# Altium schematic sheet Sheet1.SchDoc: DarkPhaser 7K
size A4; CompanyName: ElectroTodos; DrawnBy: Juan ET; Revision: A; SheetNumber: 1; SheetTotal: 1; Number: 25
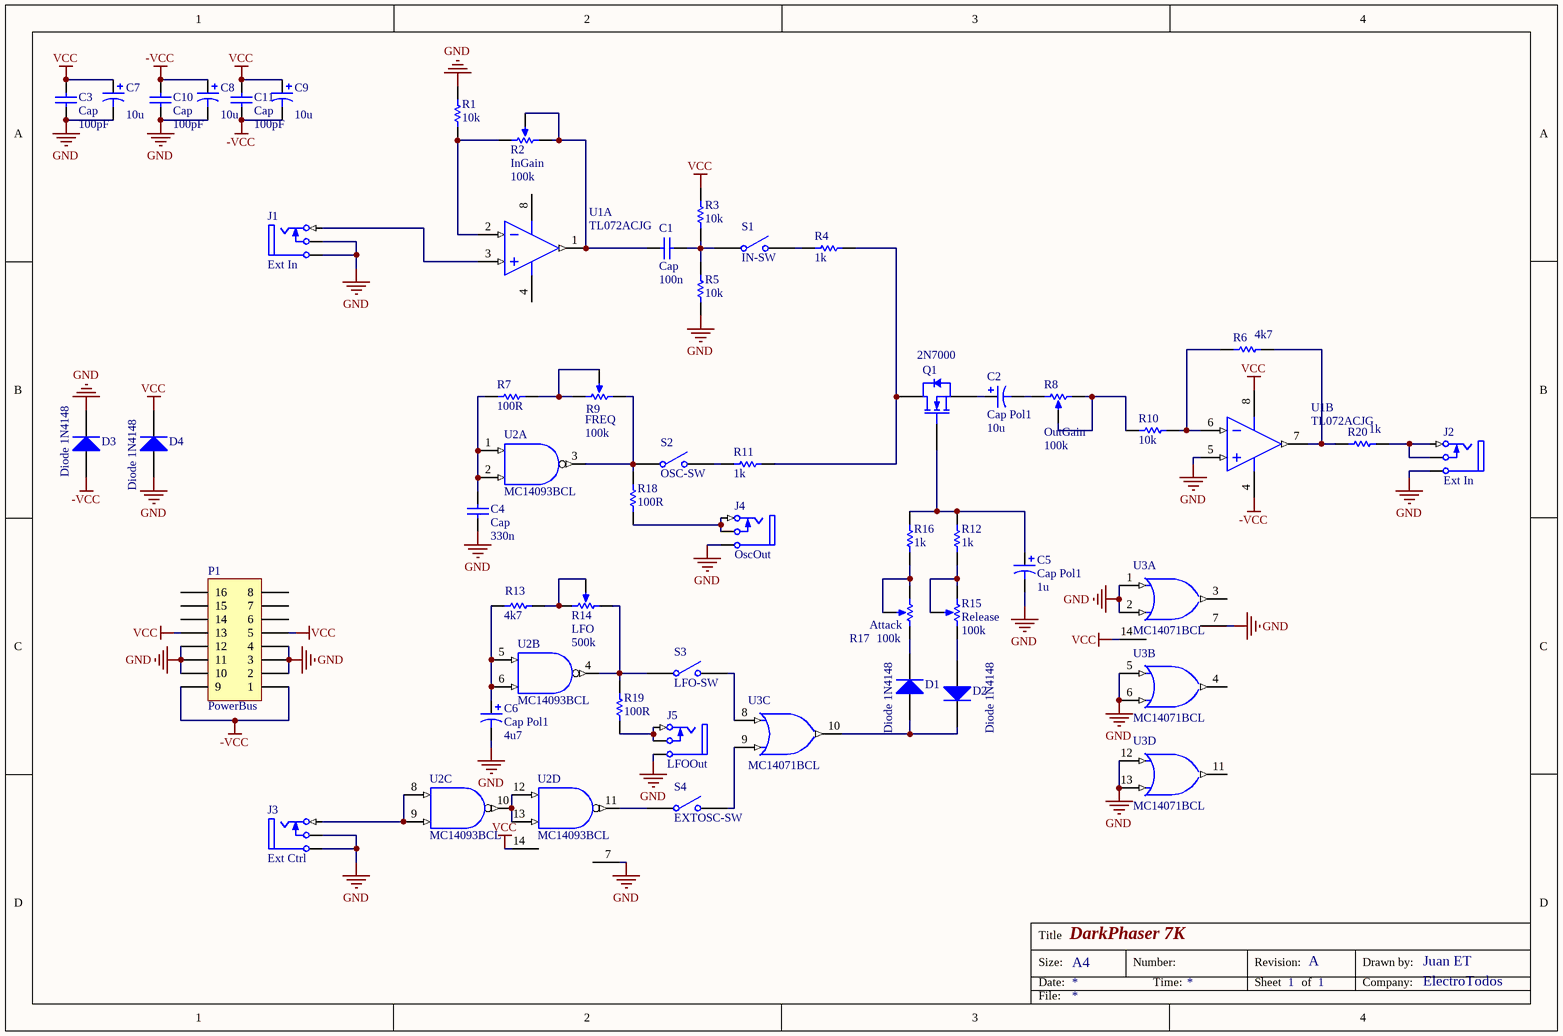
[diagram p0: Sheet1.SchDoc]

## Parts
C1  Cap  value 100n  [RAD-0.1]
C2  Cap Pol1  value 10u  [Cap Radial]
C3  Cap  value 100pF  [RAD-0.1]
C4  Cap  value 330n  [RAD-0.1]
C5  Cap Pol1  value 1u  [Cap Radial]
C6  Cap Pol1  value 4u7  [Cap Radial]
C7  value 10u  [Cap Radial]  (hidden comment: Cap Pol1)
C8  value 10u  [Cap Radial]  (hidden comment: Cap Pol1)
C9  value 10u  [Cap Radial]  (hidden comment: Cap Pol1)
C10  Cap  value 100pF  [RAD-0.1]
C11  Cap  value 100pF  [RAD-0.1]
D1  Diode 1N4148  [DO-35]
D2  Diode 1N4148  [DO-35]
D3  Diode 1N4148  [DO-35]
D4  Diode 1N4148  [DO-35]
J1  Ext In  [HDR1X3]
J2  Ext In  [HDR1X3]
J3  Ext Ctrl  [HDR1X3]
J4  OscOut  [HDR1X3]
J5  LFOOut  [HDR1X3]
P1  PowerBus  [HDR2X8_CEN]
Q1  2N7000  [SOT54]
R1  value 10k  [AXIAL-0.3]
R2  InGain  value 100k  [HDR1X3]
R3  value 10k  [AXIAL-0.3]
R4  value 1k  [AXIAL-0.3]
R5  value 10k  [AXIAL-0.3]
R6  value 4k7  [AXIAL-0.3]
R7  value 100R  [AXIAL-0.3]
R8  OutGain  value 100k  [HDR1X3]
R9  FREQ  value 100k  [HDR1X3]
R10  value 10k  [AXIAL-0.3]
R11  value 1k  [AXIAL-0.3]
R12  value 1k  [AXIAL-0.3]
R13  value 4k7  [AXIAL-0.3]
R14  LFO  value 500k  [HDR1X3]
R15  Release  value 100k  [HDR1X3]
R16  value 1k  [AXIAL-0.3]
R17  Attack  value 100k  [HDR1X3]
R18  value 100R  [AXIAL-0.3]
R19  value 100R  [AXIAL-0.3]
R20  value 1k  [AXIAL-0.3]
S1  IN-SW  [PIN2]
S2  OSC-SW  [PIN2]
S3  LFO-SW  [PIN2]
S4  EXTOSC-SW  [PIN2]
U1  TL072ACJG  [693-02]  (parts A,B of 2)
U2  MC14093BCL  [632-08]  (parts A,B,C,D of 4)
U3  MC14071BCL  [632-08]  (parts A,B,C,D of 4)

## Nets
-VCC: C8.1 C9.2 C10.2 C11.1 D3.1(A) P1.1 P1.9 U1.4(V-)
GND: C3.2 C4.1 C5.2 C6.2 C7.2 C8.2 C10.1 D3.2(K) D4.1(A) J1.2(TN) J1.5(S) J2.5(S) J3.2(TN) J3.5(S) J4.5(S) J5.5(S) P1.2 P1.3 P1.4 P1.10 P1.11 P1.12 R1.2 R5.2 U1.5(IN+) U2.7(GND) U3.1(A) U3.2(B) U3.5(A) U3.6(B) U3.7(GND) U3.12(A) U3.13(B)
VCC: C3.1 C7.1 C9.1 C11.2 D4.2(K) P1.5 P1.13 R3.1 U1.8(V+) U2.14(VDD) U3.14(VDD)  [also labelled VDD]
NetC1_1: C1.1 R3.2 R5.1 S1.1(COMMON)
NetC1_2: C1.2 R2.1(TOP) R2.3(TAP) U1.1(OUT)
NetC2_1: C2.1 Q1.3(S)
NetC2_2: C2.2 R8.1(TOP)
NetC4_2: C4.2 R7.1 U2.1(A) U2.2(B)
NetC5_1: C5.1 Q1.2(G) R12.2 R16.2
NetC6_1: C6.1 R13.1 U2.5(A) U2.6(B)
NetD1_1: D1.1(A) D2.2(K) U3.10(Y)
NetD1_2: D1.2(K) R17.2(BOT)
NetD2_1: D2.1(A) R15.2(BOT)
NetJ1_1: J1.1(T) U1.3(IN+)
NetJ2_1: J2.1(T) J2.2(TN) R20.1
NetJ3_1: J3.1(T) U2.8(A) U2.9(B)
NetJ4_1: J4.1(T) J4.2(TN) R18.1
NetJ5_1: J5.1(T) J5.2(TN) R19.1
NetQ1_1: Q1.1(D) R4.2 R11.2
NetR1_1: R1.1 R2.2(BOT) U1.2(IN-)
NetR4_1: R4.1 S1.2(NO)
NetR6_1: R6.1 R20.2 U1.7(OUT)
NetR6_2: R6.2 R10.1 U1.6(IN-)
NetR7_2: R7.2 R9.2(BOT) R9.3(TAP)
NetR8_2: R8.2(BOT) R8.3(TAP) R10.2
NetR9_1: R9.1(TOP) R18.2 S2.1(COMMON) U2.3(~{Y})
NetR11_1: R11.1 S2.2(NO)
NetR12_1: R12.1 R15.1(TOP) R15.3(TAP)
NetR13_2: R13.2 R14.2(BOT) R14.3(TAP)
NetR14_1: R14.1(TOP) R19.2 S3.1(COMMON) U2.4(~{Y})
NetR16_1: R16.1 R17.1(TOP) R17.3(TAP)
NetS3_2: S3.2(NO) U3.8(A)
NetS4_1: S4.1(COMMON) U2.11(~{Y})
NetS4_2: S4.2(NO) U3.9(B)
NetU2_10: U2.10(~{Y}) U2.12(A) U2.13(B)

Not connected (* = marked no-connect by the designer): P1 6 7 8 14 15 16; U3 3(Y) 4(Y) 11(Y)

## Notes on the sheet
- Title
- Size:
- Date:
- A4
- Number:
- Time:
- Revision:
- Sheet
- of
- Drawn by:
- Company:
- File:

## Library data of the parts
C1 C3 C4 C10 C11 = Cap: Capacitor; Published: 8-Jun-2000; LatestRevisionDate: 17-Jul-2002; LatestRevisionNote: Re-released for DXP Platform.; PackageReference: RAD-0.3; Publisher: Altium Limited; PackageDescription: Radial Cap, Thru-Hole; 2 Leads; 0.3 in Pin Spacing
C2 C5-C9 = Cap Pol1: Polarized Capacitor (Radial); Published: 8-Jun-2000; LatestRevisionDate: 17-Jul-2002; LatestRevisionNote: Re-released for DXP Platform.; PackageReference: RB7.6-15; Publisher: Altium Limited; PackageDescription: Polarized Capacitor (Radial); 2 Leads
D1-D4 = Diode 1N4148: High Conductance Fast Diode; Published: 8-Jun-2000; LatestRevisionDate: 17-Jul-2002; LatestRevisionNote: Re-released for DXP Platform.; DatasheetVersion: 1997; PackageReference: DO-35; Publisher: Altium Limited; PackageDescription: Diode, Axial; Body 3.8 x 1.9 mm (LxDia. max), Lead Dia. 0.53 mm (max); Code_JEDEC: DO-204-AH; ComponentLink1Description: Manufacturer Link; ComponentLink1URL: http://www.fairchildsemi.com/; ComponentLink2Description: Datasheet; ComponentLink2URL: http://www.fairchildsemi.com/ds/1N%2F1N4148.pdf
J1-J5 = Phonejack2 TN: Jack Socket, 1/4" [6.5mm], Thru-Hole, Vertical, 2-Conductor with Tip closed; pin to pad: 5>3; PackageDocument: 2003; PCB_Layout: Complies with manufacturer's recommendation.; DrillAndSlotSize: Corresponds to nominal value.; LatestRevisionDate: 15-Jul-2004; LatestRevisionNote: Component Replaced & renamed from "Phonejack".; DatasheetDocument: 2003; PackageReference: S1VS_SNB; Publisher: Altium Limited; ComponentLink1Description: Manufacturer Link; ComponentLink1URL: http://www.cliffuk.co.uk/
P1 = Header 8X2A: Header, 8-Pin, Dual row; LatestRevisionDate: 17-Jul-2002; LatestRevisionNote: Re-released for DXP Platform.; Publisher: Altium Limited
Q1 = 2N7000: N-channel Enhancement Mode Field-effect Transistor; Published: 17-Sep-2003; LatestRevisionDate: 12-Dec-2006; LatestRevisionNote: Footprint pad sequence fixed.; DatasheetVersion: 19-May-2000; PackageVersion: Feb-1997; PackageReference: SOT54; Publisher: Altium Limited; PackageDescription: Plastic Single-Ended Leaded (through hole) package; 3 Leads (TO-92); Code_JEITA: SC-43; Code_JEDEC: TO-92; ComponentLink1Description: Manufacturer Link; ComponentLink1URL: http://www.semiconductors.philips.com/; ComponentLink2Description: Datasheet; ComponentLink2URL: http://www.semiconductors.philips.com/acrobat/datasheets/2N7000-03.pdf
R1 R3-R7 R10-R13 R16 R18-R20 = Res1: Resistor; Published: 8-Jun-2000; LatestRevisionDate: 17-Jul-2002; LatestRevisionNote: Re-released for DXP Platform.; PackageReference: AXIAL-0.3; Publisher: Altium Limited; PackageDescription: Axial Device, Thru-Hole; 2 Leads; 0.3 in Pin Spacing
R2 R15 R17 = RPot: Potentiometer; pin to pad: 2>3 3>2; Sim Note: Enter the Resistance value and the set point into parameter fields.; Set Position: 0.5; Published: 8-Jun-2000; LatestRevisionDate: 17-Jul-2002; LatestRevisionNote: Re-released for DXP Platform.; PackageReference: VR5; Publisher: Altium Limited; PackageDescription: Variable Resistor, Thru-Hole; 3 Leads
R8 R9 R14 = RPot: Potentiometer; Sim Note: Enter the Resistance value and the set point into parameter fields.; Set Position: 0.5; Published: 8-Jun-2000; LatestRevisionDate: 17-Jul-2002; LatestRevisionNote: Re-released for DXP Platform.; PackageReference: VR5; Publisher: Altium Limited; PackageDescription: Variable Resistor, Thru-Hole; 3 Leads
S1-S4 = SW-SPST: Single-Pole, Single-Throw Switch; Published: 24-Mar-1999; LatestRevisionDate: 17-Jul-2002; LatestRevisionNote: Re-released for DXP Platform.; PackageReference: SPST-2; Publisher: Altium Limited; PackageDescription: Switch; 2 Leads
U1 = TL072ACJG: Low-Noise JFET-Input Operational Amplifier; Published: 17-Jul-2002; LatestRevisionDate: 06-Jun-2005; LatestRevisionNote: Stylized 3D Model Added.; DatasheetVersion: 1988; PackageReference: 693-02; Publisher: Altium Limited; PackageDescription: DIP; 8 Leads; Row Spacing 7.62 mm; Pitch 2.54 mm; Code_JEDEC: MO-001-AN; ComponentLink1Description: Manufacturer Link; ComponentLink1URL: http://www.onsemi.com/site/products/parametrics/0,4446,251,00.html
U2 = MC14093BCL: Quad 2-Input NAND Schmitt Trigger; Published: 15-Apr-2002; DatasheetVersion: 1995; PackageVersion: 1995; PackageReference: 632-08; Publisher: Altium Limited; PackageDescription: DIP; 14 Leads; Row Spacing 7.62 mm; Pitch 2.54 mm; ComponentLink1Description: Manufacturer Link; ComponentLink1URL: http://www.onsemi.com/; ComponentLink2Description: Datasheet; ComponentLink2URL: http://www.onsemi.com/pub/Collateral/MC14093B-D.PDF
U3 = MC14071BCL: Quad 2-Input OR Gate; Published: 15-Apr-2002; DatasheetVersion: 1995; PackageVersion: 1995; PackageReference: 632-08; Publisher: Altium Limited; PackageDescription: DIP; 14 Leads; Row Spacing 7.62 mm; Pitch 2.54 mm; ComponentLink1Description: Manufacturer Link; ComponentLink1URL: http://www.onsemi.com/; ComponentLink2Description: Datasheet; ComponentLink2URL: http://www.onsemi.com/pub/Collateral/MC14001B-D.PDF